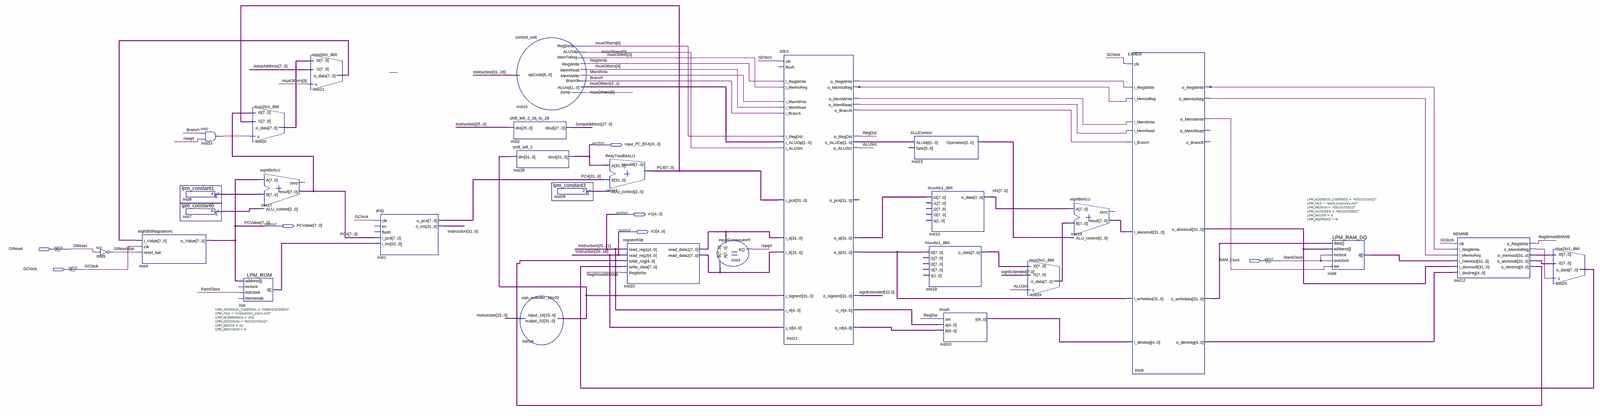
[diagram p0: schematic sheet, whole]
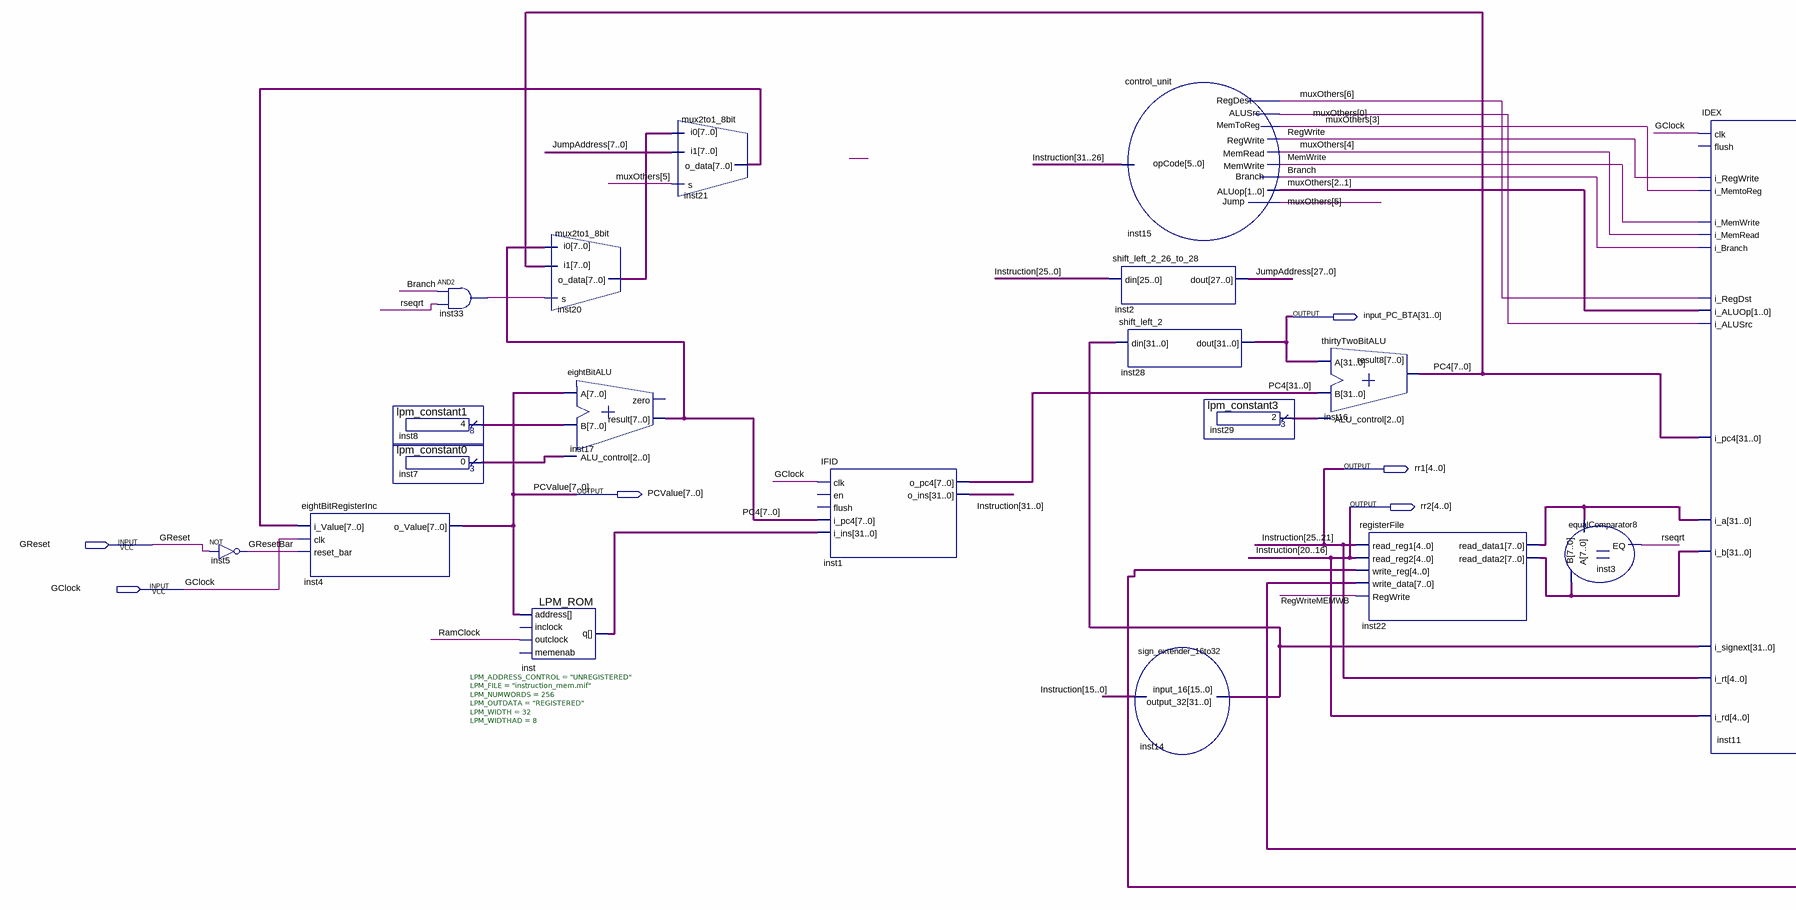
[diagram p1: schematic sheet, left part]
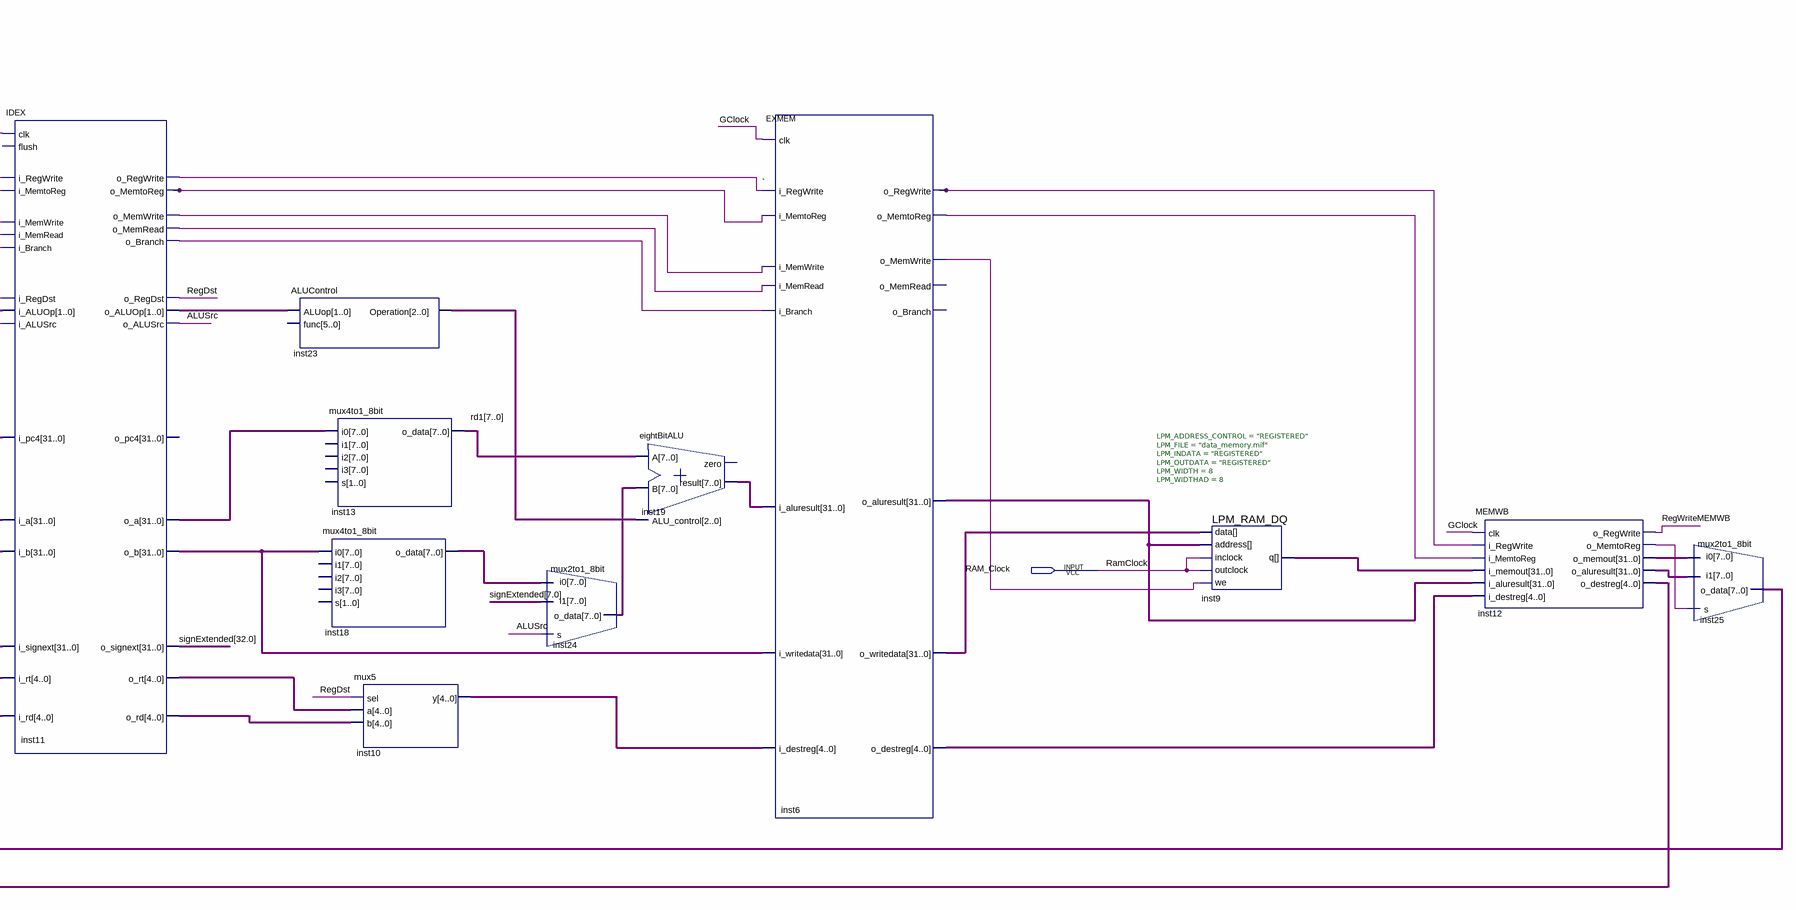
[diagram p2: schematic sheet, right part]
// Quartus schematic Lab3.bdf as structural Verilog: 29 symbols, 7 pins
module Lab3 (
  input  GReset,
  input  RAM_Clock,
  input  GClock,
  output [31:0] input_PC_BTA,
  output [4:0] rr1,
  output [7:0] PCValue,
  output [4:0] rr2
);

  wire \` , ALUSrc, Branch, GResetBar, inst6_o_memtoreg, inst6_o_memwrite, inst6_o_regwrite, inst11_o_branch,
       inst11_o_memread, inst11_o_memtoreg, inst11_o_memwrite, inst12_o_memtoreg, inst33_out, MemWrite,
       RegDst, RegWrite, RegWriteMEMWB, rseqrt, \signExtended[7.0] , \signExtended[32.0] ;
  wire [1:0] inst11_o_aluop;
  wire [2:0] inst7_result, inst23_operation, inst29_result;
  wire [4:0] inst6_o_destreg, inst10_y, inst11_o_rd, inst11_o_rt, inst12_o_destreg;
  wire [6:0] muxOthers;
  wire [7:0] inst8_result, inst18_o_data, inst20_o_data, inst21_o_data, inst24_o_data, inst25_o_data, rd1;
  wire [27:0] JumpAddress;
  wire [31:0] inst6_o_aluresult, inst6_o_writedata, inst9_q, inst11_o_a, inst11_o_b, inst12_o_aluresult,
       inst12_o_memout, inst14_output_32, inst19_result, inst22_read_data1, inst22_read_data2, inst_q,
       Instruction, PC4;

  not inst5 (GResetBar, GReset);
  eightBitRegisterInc inst4 (.i_Value(inst21_o_data), .clk(GClock), .reset_bar(GResetBar), .o_Value(PCValue));
  and inst33 (inst33_out, Branch, rseqrt);
  lpm_constant1 inst8 (.result(inst8_result));
  lpm_constant0 inst7 (.result(inst7_result));
  LPM_ROM #(.LPM_ADDRESS_CONTROL("UNREGISTERED"), .LPM_FILE("instruction_mem.mif"), .LPM_NUMWORDS(256), .LPM_OUTDATA("REGISTERED"), .LPM_WIDTH(32), .LPM_WIDTHAD(8)) inst (
    .address(PCValue), .outclock(RAM_Clock), .q(inst_q));  // open: inclock, memenab
  mux2to1_8bit inst20 (.i0(PC4[7:0]), .i1(PC4[7:0]), .s(inst33_out), .o_data(inst20_o_data));
  eightBitALU inst17 (.A(PCValue), .B(inst8_result), .ALU_control(inst7_result), .result(PC4[7:0]));  // open: zero
  mux2to1_8bit inst21 (.i0(inst20_o_data), .i1(JumpAddress[7:0]), .s(muxOthers[5]), .o_data(inst21_o_data));
  IFID inst1 (
    .clk(GClock), .i_pc4(PC4[7:0]), .i_ins(inst_q), .o_pc4(PC4),
    .o_ins({Instruction[31:26], rr1, rr2, Instruction[15:0]}));  // open: en, flush
  control_unit inst15 (
    .opCode(Instruction[31:26]), .RegDest(muxOthers[6]), .ALUSrc(muxOthers[0]), .MemToReg(muxOthers[3]),
    .RegWrite(RegWrite), .MemRead(muxOthers[4]), .MemWrite(MemWrite), .Branch(Branch),
    .ALUop(muxOthers[2:1]), .Jump(muxOthers[5]));
  shift_left_2_26_to_28 inst2 (.din({rr1, rr2, Instruction[15:0]}), .dout(JumpAddress));
  shift_left_2 inst28 (.din(inst14_output_32), .dout(input_PC_BTA));
  sign_extender_16to32 inst14 (.input_16(Instruction[15:0]), .output_32(inst14_output_32));
  lpm_constant3 inst29 (.result(inst29_result));
  thirtyTwoBitALU inst16 (.A(input_PC_BTA), .B(PC4), .ALU_control(inst29_result), .result8(PC4[7:0]));
  registerFile inst22 (
    .read_reg1(rr1), .read_reg2(rr2), .write_reg(inst12_o_destreg), .write_data(inst25_o_data),
    .RegWrite(RegWriteMEMWB), .read_data1(inst22_read_data1), .read_data2(inst22_read_data2));
  equalComparator8 inst3 (.A(inst22_read_data1), .B(inst22_read_data2), .EQ(rseqrt));
  IDEX inst11 (
    .clk(GClock), .i_RegWrite(RegWrite), .i_MemtoReg(muxOthers[3]), .i_MemWrite(MemWrite),
    .i_MemRead(muxOthers[4]), .i_Branch(Branch), .i_RegDst(muxOthers[6]), .i_ALUOp(muxOthers[2:1]),
    .i_ALUSrc(muxOthers[0]), .i_pc4(PC4[7:0]), .i_a(inst22_read_data1), .i_b(inst22_read_data2),
    .i_signext(inst14_output_32), .i_rt(rr1), .i_rd(rr2), .o_RegWrite(\` ), .o_MemtoReg(inst11_o_memtoreg),
    .o_MemWrite(inst11_o_memwrite), .o_MemRead(inst11_o_memread), .o_Branch(inst11_o_branch),
    .o_RegDst(RegDst), .o_ALUOp(inst11_o_aluop), .o_ALUSrc(ALUSrc), .o_a(inst11_o_a), .o_b(inst11_o_b),
    .o_signext(\signExtended[32.0] ), .o_rt(inst11_o_rt), .o_rd(inst11_o_rd));  // open: flush, o_pc4
  ALUControl inst23 (.ALUop(inst11_o_aluop), .Operation(inst23_operation));  // open: func
  mux4to1_8bit inst13 (.i0(inst11_o_a), .o_data(rd1));  // open: i1, i2, i3, s
  mux4to1_8bit inst18 (.i0(inst11_o_b), .o_data(inst18_o_data));  // open: i1, i2, i3, s
  mux5 inst10 (.sel(RegDst), .a(inst11_o_rt), .b(inst11_o_rd), .y(inst10_y));
  mux2to1_8bit inst24 (.i0(inst18_o_data), .i1({8{\signExtended[7.0] }}), .s(ALUSrc), .o_data(inst24_o_data));
  eightBitALU inst19 (
    .A(rd1), .B(inst24_o_data), .ALU_control(inst23_operation), .result(inst19_result));  // open: zero
  EXMEM inst6 (
    .clk(GClock), .i_RegWrite(\` ), .i_MemtoReg(inst11_o_memtoreg), .i_MemWrite(inst11_o_memwrite),
    .i_MemRead(inst11_o_memread), .i_Branch(inst11_o_branch), .i_aluresult(inst19_result),
    .i_writedata(inst11_o_b), .i_destreg(inst10_y), .o_RegWrite(inst6_o_regwrite),
    .o_MemtoReg(inst6_o_memtoreg), .o_MemWrite(inst6_o_memwrite), .o_aluresult(inst6_o_aluresult),
    .o_writedata(inst6_o_writedata), .o_destreg(inst6_o_destreg));  // open: o_MemRead, o_Branch
  LPM_RAM_DQ #(.LPM_ADDRESS_CONTROL("REGISTERED"), .LPM_FILE("data_memory.mif"), .LPM_INDATA("REGISTERED"), .LPM_OUTDATA("REGISTERED"), .LPM_WIDTH(8), .LPM_WIDTHAD(8)) inst9 (
    .inclock(RAM_Clock), .data(inst6_o_writedata), .address(inst6_o_aluresult), .we(inst6_o_memwrite),
    .outclock(RAM_Clock), .q(inst9_q));
  MEMWB inst12 (
    .clk(GClock), .i_RegWrite(inst6_o_regwrite), .i_MemtoReg(inst6_o_memtoreg), .i_memout(inst9_q),
    .i_aluresult(inst6_o_aluresult), .i_destreg(inst6_o_destreg), .o_RegWrite(RegWriteMEMWB),
    .o_MemtoReg(inst12_o_memtoreg), .o_memout(inst12_o_memout), .o_aluresult(inst12_o_aluresult),
    .o_destreg(inst12_o_destreg));
  mux2to1_8bit inst25 (.i0(inst12_o_memout), .i1(inst12_o_aluresult), .s(inst12_o_memtoreg), .o_data(inst25_o_data));

  // Other names for the same wires on the sheet: Instruction[25:16] = {rr1, rr2}; RamClock = RAM_Clock
endmodule
